# EAGLE design amp_kit_v02 (EAGLE 6.1)
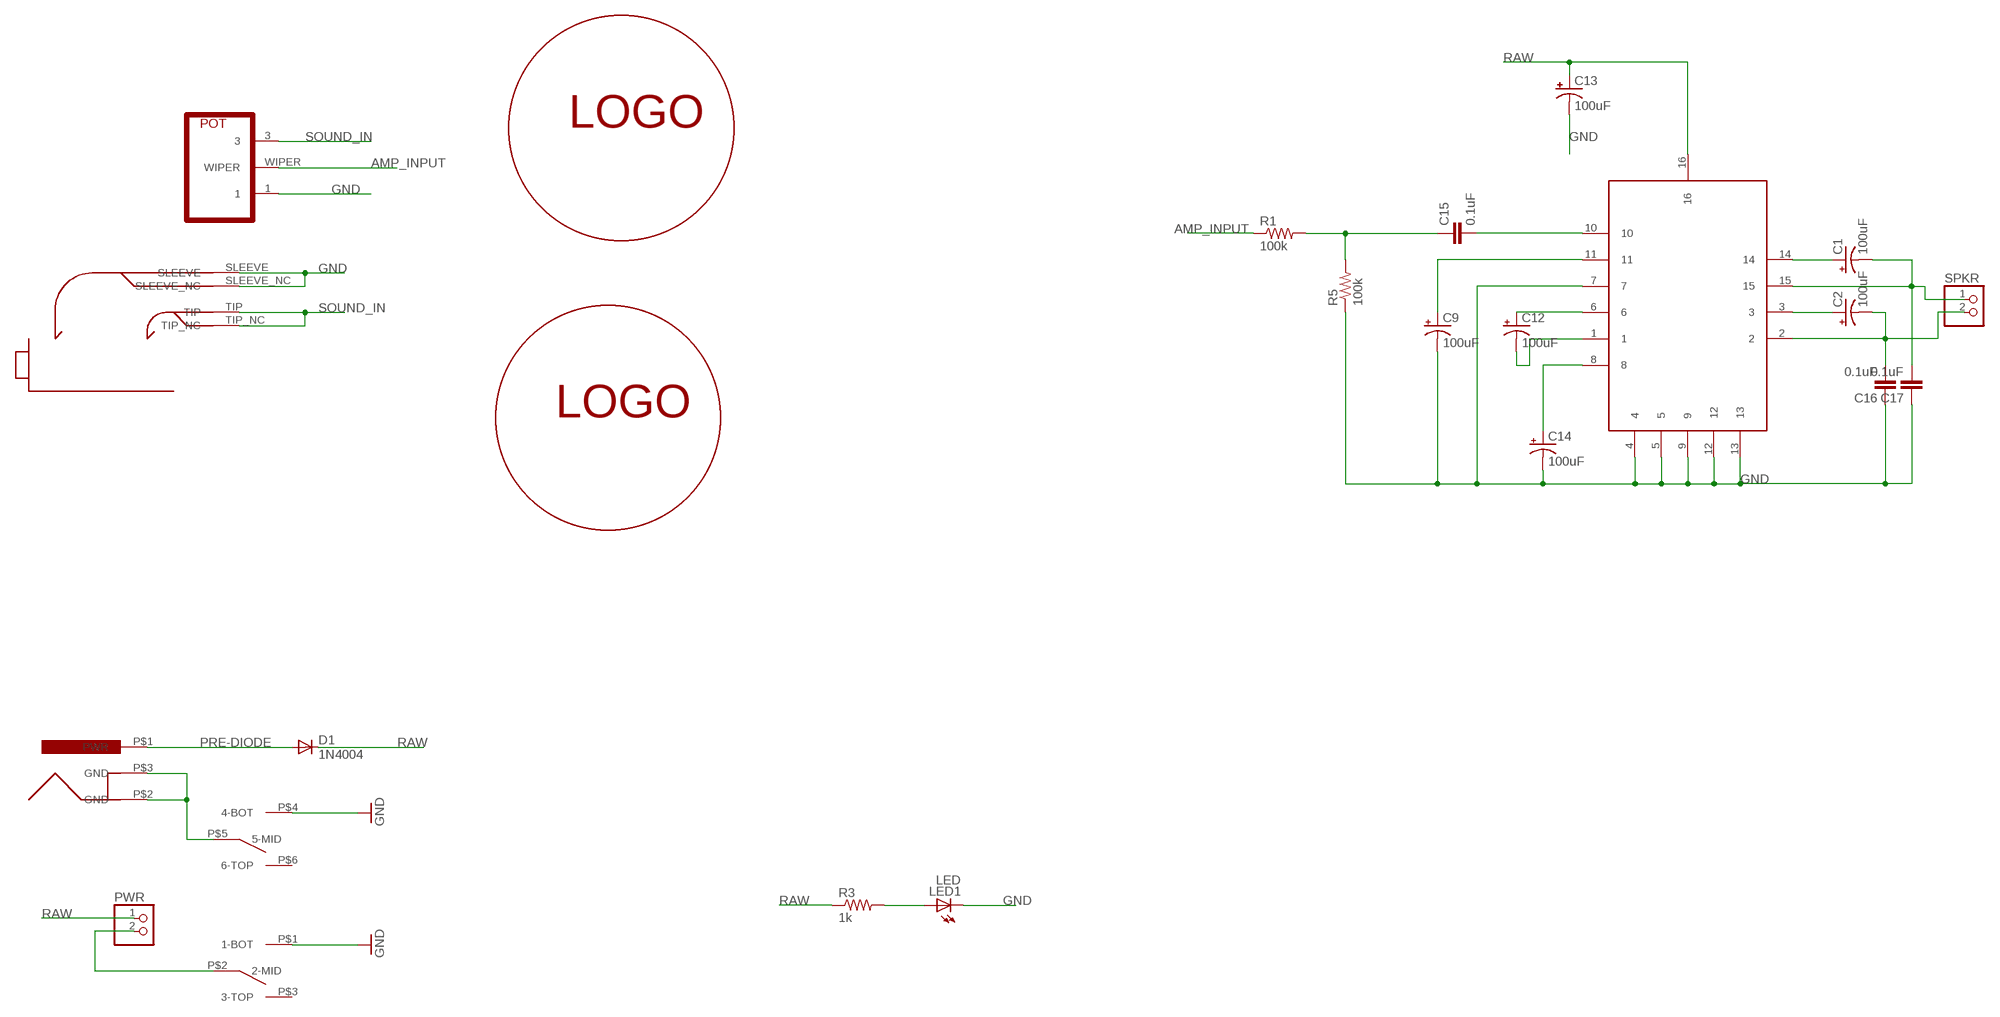
[diagram p0: schematic, sheet 1]

## Parts
C1  100uF  CPOL-USE2.5-7  [E2,5-7]
C2  100uF  CPOL-USE2.5-7  [E2,5-7]
C9  100uF  CPOL-USE2.5-7  [E2,5-7]
C12  100uF  CPOL-USE2.5-7  [E2,5-7]
C13  100uF  CPOL-USE2.5-7  [E2,5-7]
C14  100uF  CPOL-USE2.5-7  [E2,5-7]
C15  0.1uF  CAP025-025X050  [C025-025X050]
C16  0.1uF  CAP025-025X050  [C025-025X050]
C17  0.1uF  CAP025-025X050  [C025-025X050]
D1  1N4004  [DO41-10]
LED1  LED  LED5MM  [LED5MM]
PWR  PINHD-1X2  [1X02]
R1  100k  R-US_0204/2V  [0204V]
R3  1k  R-US_0207/10  [0207/10]
R5  100k  R-US_0204/2V  [0204V]
SPKR  PINHD-1X2  [1X02]
U$1  TEA2025  [DIL16]
U$2  LOGOCG  [LOGO-CG]
U$3  POT_BOX_AMP  [POT_BOX_AMP]
U$4  PUSHPOWER  [PUSHPOWER]
U$5  POWER_JACK  [POWER_JACK]
U$6  MONO_PHONE  [MONO_PHONE]
U$7  LOGOCG  [LOGO-CG]

## Nets
AMP_INPUT: R1.1 U$3.WIPER
GND [power]: C9.- C13.- C14.- C16.1 C17.1 LED1.K(C) R5.1 U$1.4 U$1.5 U$1.7 U$1.9 U$1.12 U$1.13 U$3.1 U$4.P$1(1-BOT) U$4.P$4(4-BOT) U$6.SLEEVE U$6.SLEEVE_NC
N$1: PWR.2 U$4.P$2(2-MID)
N$2: LED1.A R3.2
N$3: C14.+ U$1.8
N$4: C12.- U$1.1
N$5: U$4.P$5(5-MID) U$5.P$2(GND) U$5.P$3(GND)
N$13: C12.+ U$1.6
N$15: C9.+ U$1.11
N$16: C2.- C16.2 SPKR.2 U$1.2
N$19: C15.2 U$1.10
N$21: C1.+ U$1.14
N$22: C2.+ U$1.3
N$23: C1.- C17.2 SPKR.1 U$1.15
N$24: C15.1 R1.2 R5.2
PRE-DIODE: D1.A U$5.P$1(PWR)
RAW [power]: C13.+ D1.C PWR.1 R3.1 U$1.16
SOUND_IN: U$3.3 U$6.TIP U$6.TIP_NC
Unconnected: U$4.P$3(3-TOP) U$4.P$6(6-TOP)

## Library data of the parts
C1 C2 C9 C12-C14 = rcl:CPOL-US: POLARIZED CAPACITOR, American symbol
C15-C17 = SparkFun:CAP: CAPACITOR
D1 = diode:1N4004: DIODE general purpose rectifier, 1 A
LED1 = led:LED: LED OSRAM: - CHIPLED LG R971, LG N971, LY N971, LG Q971, LY Q971, LO R971, LY R971 LH N974, LH R974 LS Q976, LO Q976, LY Q976 LO Q996 - Hyper CHIPLED LW Q18S LB Q993, LB Q99A, LB R99A - SideLED LS A670, LO A670, LY A670, LG A670, LP A670 LB A673, LV A673, LT A673, LW A673 LH A674 LY A675 LS A676, LA A676, LO A676, LY A676, LW A676 LS A679, LY A679, LG A679 - Hyper Micro SIDELED® LS Y876, LA Y876, LO Y876, LY Y876 LT Y87S - SmartLED LW L88C, LW L88S LB L89C, LB L89S, LG L890 LS L89K, LO L89K, LY L89K LS L896, LA L896, LO L896, LY L896 - TOPLED LS T670, LO T670, LY T670, LG T670, LP T670 LSG T670, LSP T670, LSY T670, LOP T670, LYG T670 LG T671, LOG T671, LSG T671 LB T673, LV T673, LT T673, LW T673 LH T674 LS T676, LA T676, LO T676, LY T676, LB T676, LH T676, LSB T676, LW T676 LB T67C, LV T67C, LT T67C, LS T67K, LO T67K, LY T67K, LW E67C LS E67B, LA E67B, LO E67B, LY E67B, LB E67C, LV E67C, LT E67C LW T67C LS T679, LY T679, LG T679 LS T770, LO T770, LY T770, LG T770, LP T770 LB T773, LV T773, LT T773, LW T773 LH T774 LS E675, LA E675, LY E675, LS T675 LS T776, LA T776, LO T776, LY T776, LB T776 LHGB T686 LT T68C, LB T68C - Hyper Mini TOPLED® LB M676 - Mini TOPLED Santana® LG M470 LS M47K, LO M47K, LY M47K Source: http://www.osram.convergy.de/
PWR SPKR = pinhead:PINHD-1X2: PIN HEADER
R1 R3 R5 = rcl:R-US_: RESISTOR, American symbol
U$1 = Osborn:TEA2025
U$2 U$7 = Osborn:LOGO
U$3 = Osborn:POT_BOX_AMP: Horizontal Pot for Box Amp Kit
U$4 = Osborn:PUSHPOWER: C&K F Series Switch When switch is in up position, pins 3 & 2 and 6 & 5 are connected. When switch is in down position, pins 1 & 2 and 4 & 5 are connected. Part #s 401-1223-ND -- pushbutton 401-1215-ND -- cap
U$5 = SparkFun:POWER_JACK
U$6 = Osborn:MONO_PHONE: Mono 0.25" Jack ----Neutrik #NRJ4HF ----Mouser #550-10284 ----Standard Plastic Nut = Mouser #550-1005

## Net classes
0 default: width 0.305 mm
1 power: width 0.381 mm

## Board
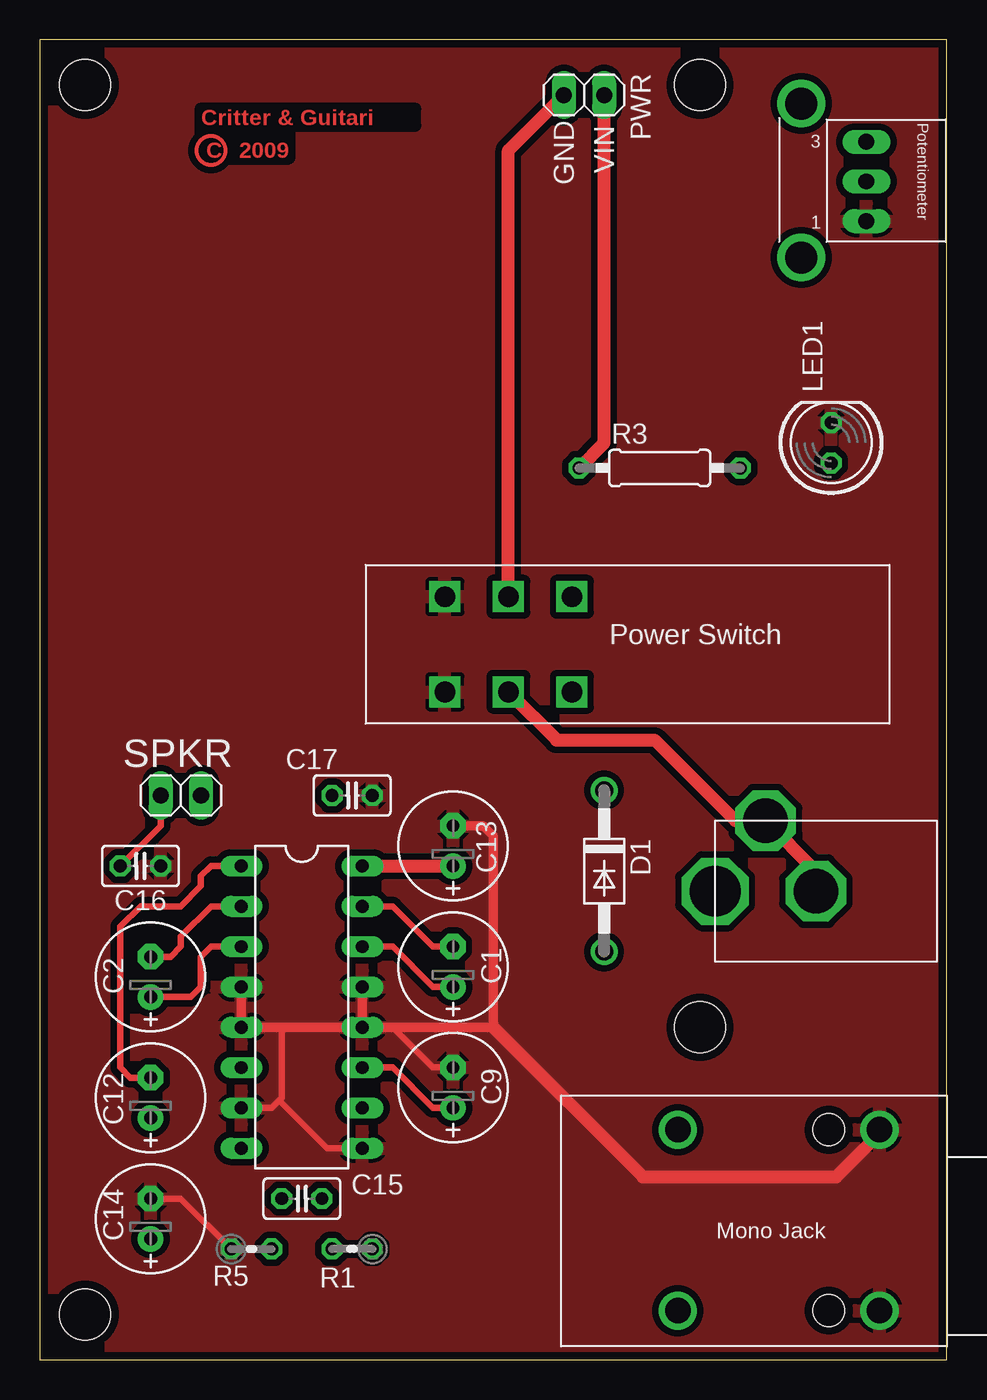
[diagram p1: board, top side]
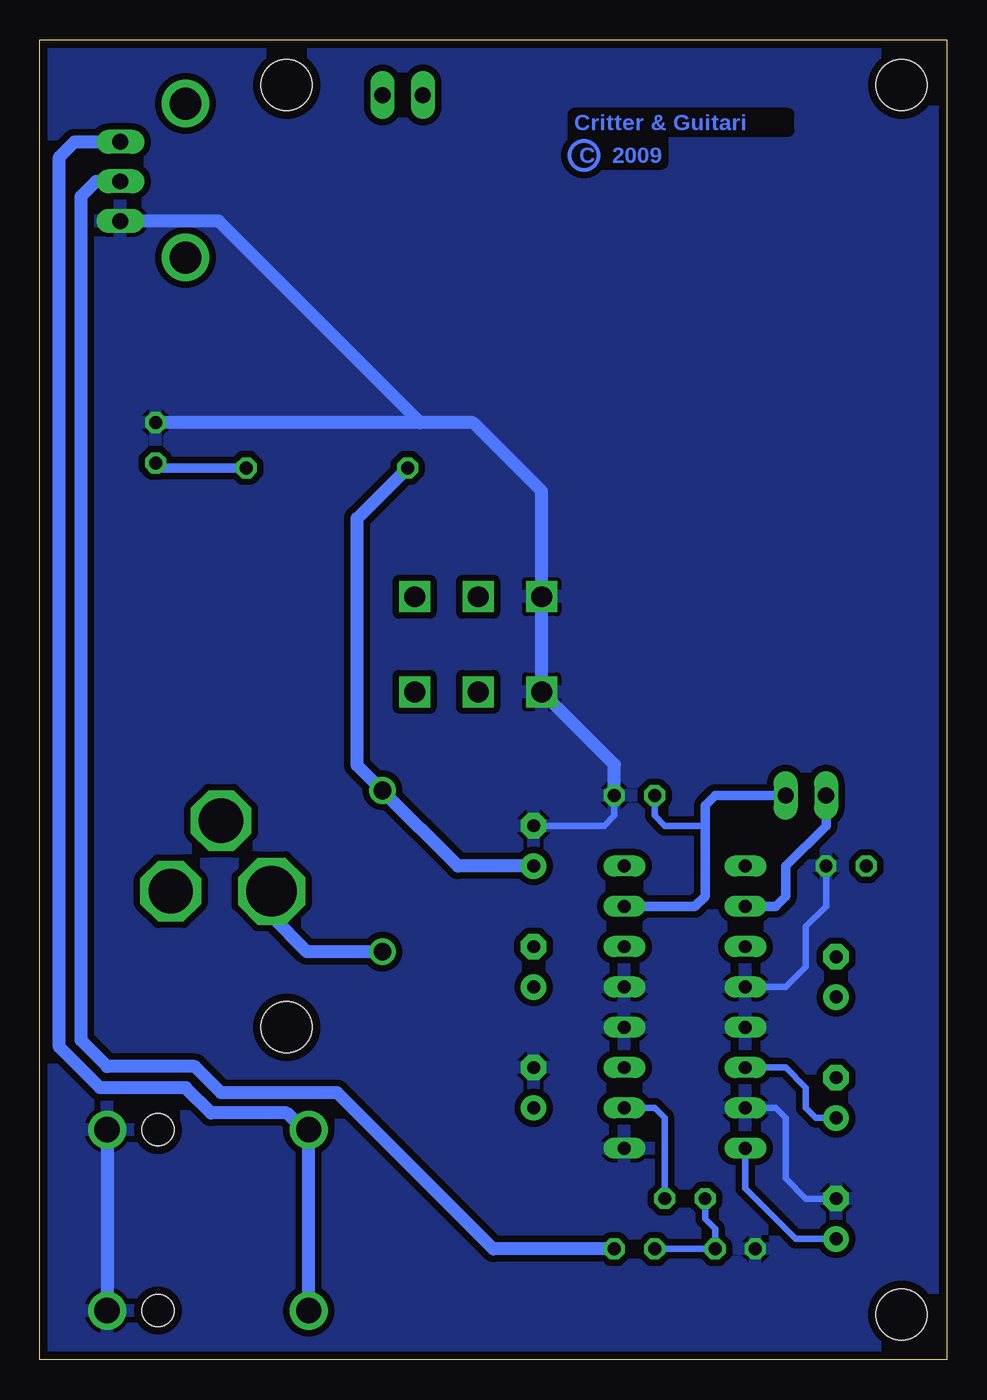
[diagram p2: board, bottom side, seen from below]

Size 57.15 x 83.19 mm. Coordinates in mm from the lower left corner, seen from the top.
Outline: 57.15,0 57.15,83.19 0,83.19 0,0 57.15,0
Copper layers (1*16): Top 0.035mm / dielectric 1.5mm / Bottom 0.035mm
Design rules: minimum track width 12mil, minimum drill 24mil, track to track 12mil, track to pad 12mil, pad to pad 12mil, via to via 10mil, smd to smd 12mil, copper to edge 20mil, drill to drill 8mil, minimum pad ring 10mil, minimum via ring 8mil, stop-mask expansion 4mil, vias tented up to drill 0mil, thermal gap 10mil
Holes 3.2 mm at 2.86,80.33 2.86,2.86 41.59,80.33 41.59,20.95

### Footprints (pad centres in the part's own frame; a part is rotated, then mirrored left to right if it is on the bottom)
E2,5-7 = drill 0.813 pad 1.6: + -1.27,0 | drill 0.813 pad 1.6 octagon: - 1.27,0
C025-025X050 = drill 0.813 octagon: 1 -1.27,0; 2 1.27,0
DO41-10 = drill 1.118: A 5.08,0; C -5.08,0
LED5MM = drill 0.813 octagon: A -1.27,0; K 1.27,0
1X02 = drill 1.016 long: 1 -1.27,0; 2 1.27,0
0204V = drill 0.813 octagon: 1 -1.27,0; 2 1.27,0
0207/10 = drill 0.813 octagon: 1 -5.08,0; 2 5.08,0
DIL16 = drill 0.813 long: 1 -8.89,-3.81; 2 -6.35,-3.81; 3 -3.81,-3.81; 4 -1.27,-3.81; 5 1.27,-3.81; 6 3.81,-3.81; 7 6.35,-3.81; 8 8.89,-3.81; 9 8.89,3.81; 10 6.35,3.81; 11 3.81,3.81; 12 1.27,3.81; 13 -1.27,3.81; 14 -3.81,3.81; 15 -6.35,3.81; 16 -8.89,3.81
POT_BOX_AMP = drill 1 pad 1.27 long: 1 0,0; 3 0,5; WIPER 0,2.5 | drill 2 pad 2.54: P$4 -4.1,7.4; P$5 -4.1,-2.3
PUSHPOWER = drill 1.3 square: P$1 -3,-4; P$2 -3,0; P$3 -3,4; P$4 3,-4; P$5 3,0; P$6 3,4
POWER_JACK = drill 3.2 octagon: P$1 0,4.445 | drill 2.8 octagon: P$2 3.175,8.89; P$3 6.35,4.445
MONO_PHONE = drill 1.6: SLEEVE -4.25,7.2; SLEEVE_NC -4.25,-4.2; TIP -16.95,7.2; TIP_NC -16.95,-4.2 | hole 2: -7.45,7.2; -7.45,-4.2

### Placement (x,y rotation side)
C1  26.04,24.77 90 top
C2  6.99,24.13 90 top
C9  26.04,17.14 90 top
C12  6.99,16.51 90 top
C13  26.04,32.38 90 top
C14  6.99,8.89 90 top
C15  16.51,10.16 0 top
C16  6.35,31.11 180 top
C17  19.68,35.56 180 top
D1  35.56,30.8 270 top
LED1  49.85,57.78 90 top
PWR  34.29,79.69 180 top
R1  19.68,6.99 180 top
R3  39.05,56.2 0 top
R5  13.34,6.99 0 top
SPKR  8.89,35.56 180 top
U$1  16.51,22.23 270 top
U$2  22.23,77.79 0 top
U$3  52.07,71.75 0 top
U$4  29.53,45.09 270 top
U$5  42.55,25.08 0 top
U$6  57.15,7.3 0 top
U$7  11.43,77.47 0 bottom

### Tracks (layer width: path | path; a pad name or v marks a point on that pad's centre or on a via)
AMP_INPUT
  Bottom 0.813: U$3.WIPER 53.6,74.25 54.55,73.31 54.55,20.13 52.9,18.48 47.37,18.48 45.72,16.83 38.42,16.83 28.57,6.99 R1.1
GND
  Top 0.406: U$1.12 22.23,20.95 24.77,18.41 C9.- | U$1.7 14.61,15.88 15.08,16.35 | 15.08,16.35 15.24,16.51 15.24,20.95 | C14.- 8.89,10.16 R5.1 | U$1.9 18.1,13.34 15.08,16.35
  Top 0.61: U$1.12 U$1.13 | U$1.12 15.24,20.95 U$1.5 U$1.4 | C13.- 27.94,33.66 28.57,33.02 28.57,20.95 U$1.12
  Top 0.813: U$4.P$4 25.4,41.96 | 52.9,14.48 U$6.SLEEVE 52.9,14.16 52.8,14.16 50.16,11.53 38.01,11.53 28.57,20.95
  Bottom 0.406: C16.1 7.62,28.57 8.89,27.3 8.89,24.77 10.16,23.5 U$1.4 | C17.1 20.95,34.29 21.59,33.66 C13.- | C14.- 8.89,10.16 10.16,11.43 10.16,15.24 10.79,15.88 U$1.7
  Bottom 0.813: 33.18,59.05 29.84,59.05 25.53,54.74 U$4.P$1 U$4.P$4 20.95,37.51 C17.1 | 33.18,59.05 LED1.K | U$6.SLEEVE U$6.SLEEVE_NC | U$3.1 45.88,71.75 33.18,59.05
  pour Bottom (isolate 0.406): -3.17,88.27 62.23,88.27 62.23,-5.08 -3.17,-5.08
  pour Top (isolate 0.406): -1.91,86.36 60.96,86.36 60.96,-2.54 -1.91,-2.54
N$1
  Top 0.813: U$4.P$2 29.53,76.2 PWR.2
N$2
  Bottom 0.61: R3.2 49.53,56.2 LED1.A
N$3
  Bottom 0.406: C14.+ 9.53,7.62 12.7,10.79 U$1.8
N$4
  Top 0.406: C12.- 5.71,17.78 5.08,18.41 5.08,27.3 6.35,28.57 8.89,28.57 10.16,29.84 10.16,30.48 10.79,31.11 U$1.1
N$5
  Top 0.61: 48.9,30.8 U$5.P$3
  Top 0.813: 48.9,30.8 U$5.P$2 43.81,33.97 38.73,39.05 32.56,39.05 U$4.P$5
N$13
  Bottom 0.406: U$1.6 10.16,18.41 8.89,17.14 8.89,15.88 8.26,15.24 C12.+
N$15
  Top 0.406: C9.+ 24.77,15.88 22.23,18.41 U$1.11
N$16
  Top 0.406: SPKR.2 7.62,33.66 C16.2 | C2.- 8.26,25.4 8.89,26.04 8.89,26.67 10.79,28.57 U$1.2
  Bottom 0.61: U$1.2 10.79,28.57 10.16,29.21 10.16,31.11 7.62,33.66 SPKR.2
N$19
  Bottom 0.406: U$1.10 18.41,15.88 17.78,15.24 C15.2
N$21
  Top 0.406: C1.+ 24.77,23.5 22.23,26.04 U$1.14
N$22
  Top 0.406: U$1.3 10.79,26.04 10.16,25.4 10.16,23.5 9.53,22.86 C2.+
N$23
  Top 0.406: C1.- 24.77,26.04 22.23,28.57 U$1.15
  Bottom 0.406: C17.2 18.41,34.29 17.78,33.66 15.24,33.66
  Bottom 0.61: U$1.15 15.88,28.57 15.24,29.21 15.24,33.66 15.24,34.92 14.61,35.56 SPKR.1
N$24
  Bottom 0.406: R1.2 R5.2 14.61,8.26 15.24,8.89 C15.1
PRE-DIODE
  Bottom 0.813: U$5.P$1 42.55,27.94 40.32,25.72 D1.A
RAW
  Top 0.813: U$1.16 C13.+ | R3.1 35.56,57.78 PWR.1
  Bottom 0.813: R3.1 37.15,53.02 37.15,37.47 D1.C 30.8,31.11 C13.+
SOUND_IN
  Bottom 0.813: U$6.TIP_NC U$6.TIP 40.54,14.5 41.59,15.56 46.35,15.56 47.94,17.14 53.34,17.14 55.91,19.72 55.91,75.79 54.94,76.75 U$3.3

### Text on the board
tPlace: GND | VIN
tValues: PWR | SPKR | Power Jack